# Altium schematic sheet GPS Receiver.SchDoc
size A3
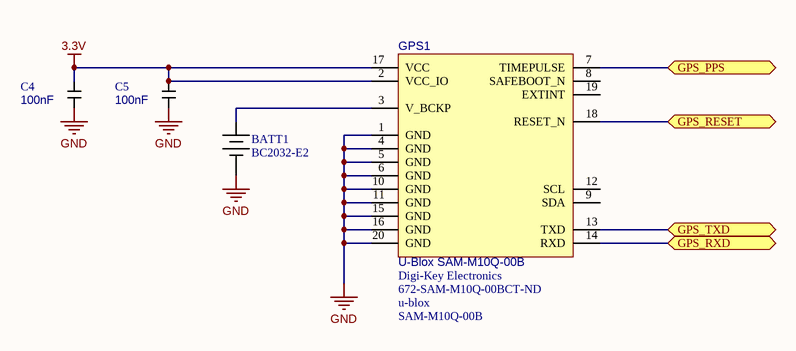
[diagram p0: GPS Receiver.SchDoc]

## Parts
?  (no value)
BATT1  BC2032-E2  [BC2032-E2]
C4  Capacitance: 100nF  [C0805]  (hidden comment: F)
C5  Capacitance: 100nF  [C0805]  (hidden comment: F)
GPS1  U-Blox SAM-M10Q-00B  Supplier: Digi-Key Electronics  Supplier Part Number: 672-SAM-M10Q-00BCT-ND  Manufacturer: u-blox  Manufacturer Part Number: SAM-M10Q-00B  [U-BLOX SAM-M10Q-00B]

## Ports
GPS_PPS, GPS_RESET, GPS_RXD, GPS_TXD

## Nets
3.3V: C4.1 C5.1 GPS1.2(VCC_IO) GPS1.17(VCC)
GND: BATT1.2 C4.2 C5.2 GPS1.1(GND) GPS1.4(GND) GPS1.5(GND) GPS1.6(GND) GPS1.10(GND) GPS1.11(GND) GPS1.15(GND) GPS1.16(GND) GPS1.20(GND)
GPS_PPS: GPS1.7(TIMEPULSE) ; port GPS_PPS
GPS_RESET: GPS1.18(RESET_N) ; port GPS_RESET
GPS_RXD: GPS1.14(RXD) ; port GPS_RXD
GPS_TXD: GPS1.13(TXD) ; port GPS_TXD
NetBATT1_1: BATT1.1 GPS1.3(V_BCKP)

Not connected (* = marked no-connect by the designer): GPS1 8(SAFEBOOT_N) 9(SDA) 12(SCL) 19(EXTINT)

## Notes on the sheet
- DRAWN BY
- CHECKED BY
- DATE
- TITLE
- Title
- Size:
- Date:
- A3
- Number:
- Time:
- Revision:
- Sheet
- of
- APPROVED BY
- RELEASED BY
- SCALE:
- SIZE
- DRAWING NUMBER
- SHEET
- -
- OF
- File:

## Library data of the parts
? = Title Block
BATT1 = BC2032-E2: Battery; Manufacturer: MPD (Memory Protection Devices); Manufacturer Part Number: BC2032-E2; Supplier Part Number: BC2032-E2-ND; Supplier: Digi-Key Electronics
C4 C5 = Capacitor: Manufacturer: Samsung Electro-Mechanics; Manufacturer Part Number: CL21B104KBCNNNC; Voltage Rating: 50V; Supplier: Digi-Key Electronics; Supplier Part Number: 1276-1003-1-ND; Price: 0.16
GPS1 = U-Blox SAM-M10Q-00B: GPS with integrated Antenna